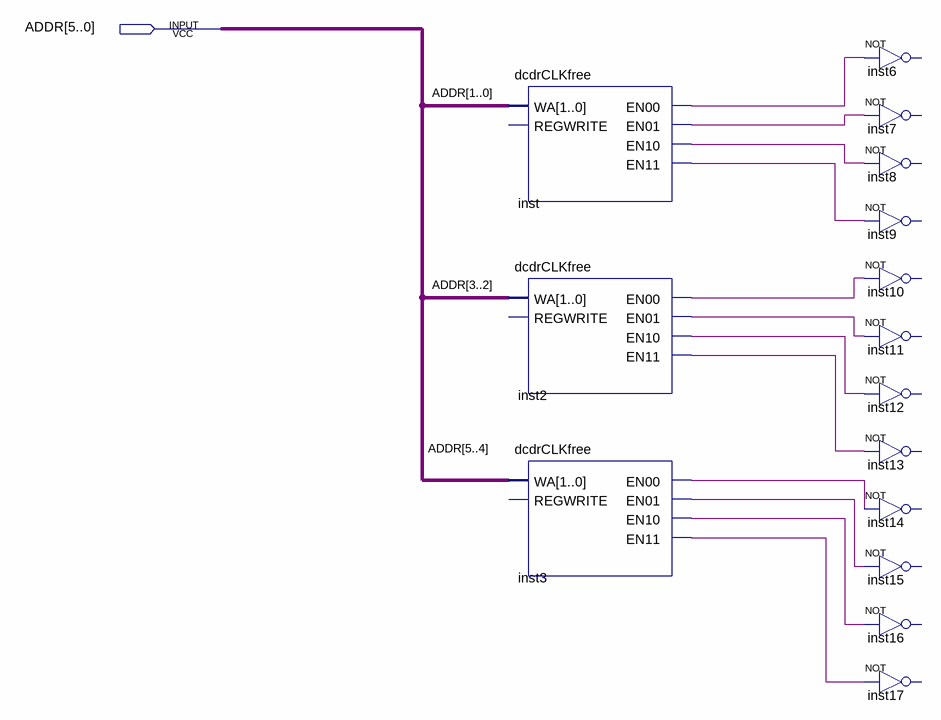
[diagram p0: schematic sheet]
// Quartus schematic decoder5bit.bdf as structural Verilog: 15 symbols, 1 pins
module decoder5bit (
  input  [5:0] ADDR
);

  wire inst2_en00, inst2_en01, inst2_en10, inst2_en11, inst3_en00, inst3_en01, inst3_en10, inst3_en11,
       inst_en00, inst_en01, inst_en10, inst_en11;

  dcdrCLKfree inst (
    .WA(ADDR[1:0]), .EN00(inst_en00), .EN01(inst_en01), .EN10(inst_en10), .EN11(inst_en11));  // open: REGWRITE
  dcdrCLKfree inst2 (
    .WA(ADDR[3:2]), .EN00(inst2_en00), .EN01(inst2_en01), .EN10(inst2_en10), .EN11(inst2_en11));  // open: REGWRITE
  dcdrCLKfree inst3 (
    .WA(ADDR[5:4]), .EN00(inst3_en00), .EN01(inst3_en01), .EN10(inst3_en10), .EN11(inst3_en11));  // open: REGWRITE
  // NOT inst6 has open pins: IN=inst_en00, OUT=open
  // NOT inst7 has open pins: IN=inst_en01, OUT=open
  // NOT inst8 has open pins: IN=inst_en10, OUT=open
  // NOT inst9 has open pins: IN=inst_en11, OUT=open
  // NOT inst10 has open pins: IN=inst2_en00, OUT=open
  // NOT inst11 has open pins: IN=inst2_en01, OUT=open
  // NOT inst12 has open pins: IN=inst2_en10, OUT=open
  // NOT inst13 has open pins: IN=inst2_en11, OUT=open
  // NOT inst14 has open pins: IN=inst3_en00, OUT=open
  // NOT inst15 has open pins: IN=inst3_en01, OUT=open
  // NOT inst16 has open pins: IN=inst3_en10, OUT=open
  // NOT inst17 has open pins: IN=inst3_en11, OUT=open
endmodule
